# EasyEDA Pro project G-CU_2023-06-21_21-38-10.eprj, schematic Schematic1
Manufacturer Part: BH-18650-B1BA002; Supplier Part: C2988620; Create Date: 2023-06-21; Page Name: P1; Project Name: G-CU_2023-06-21_21-38-10; Schematic Name: Schematic1; Update Date: 2023-06-28; Company: 嘉立创EDA; Page Size: A4; Version: V1.0
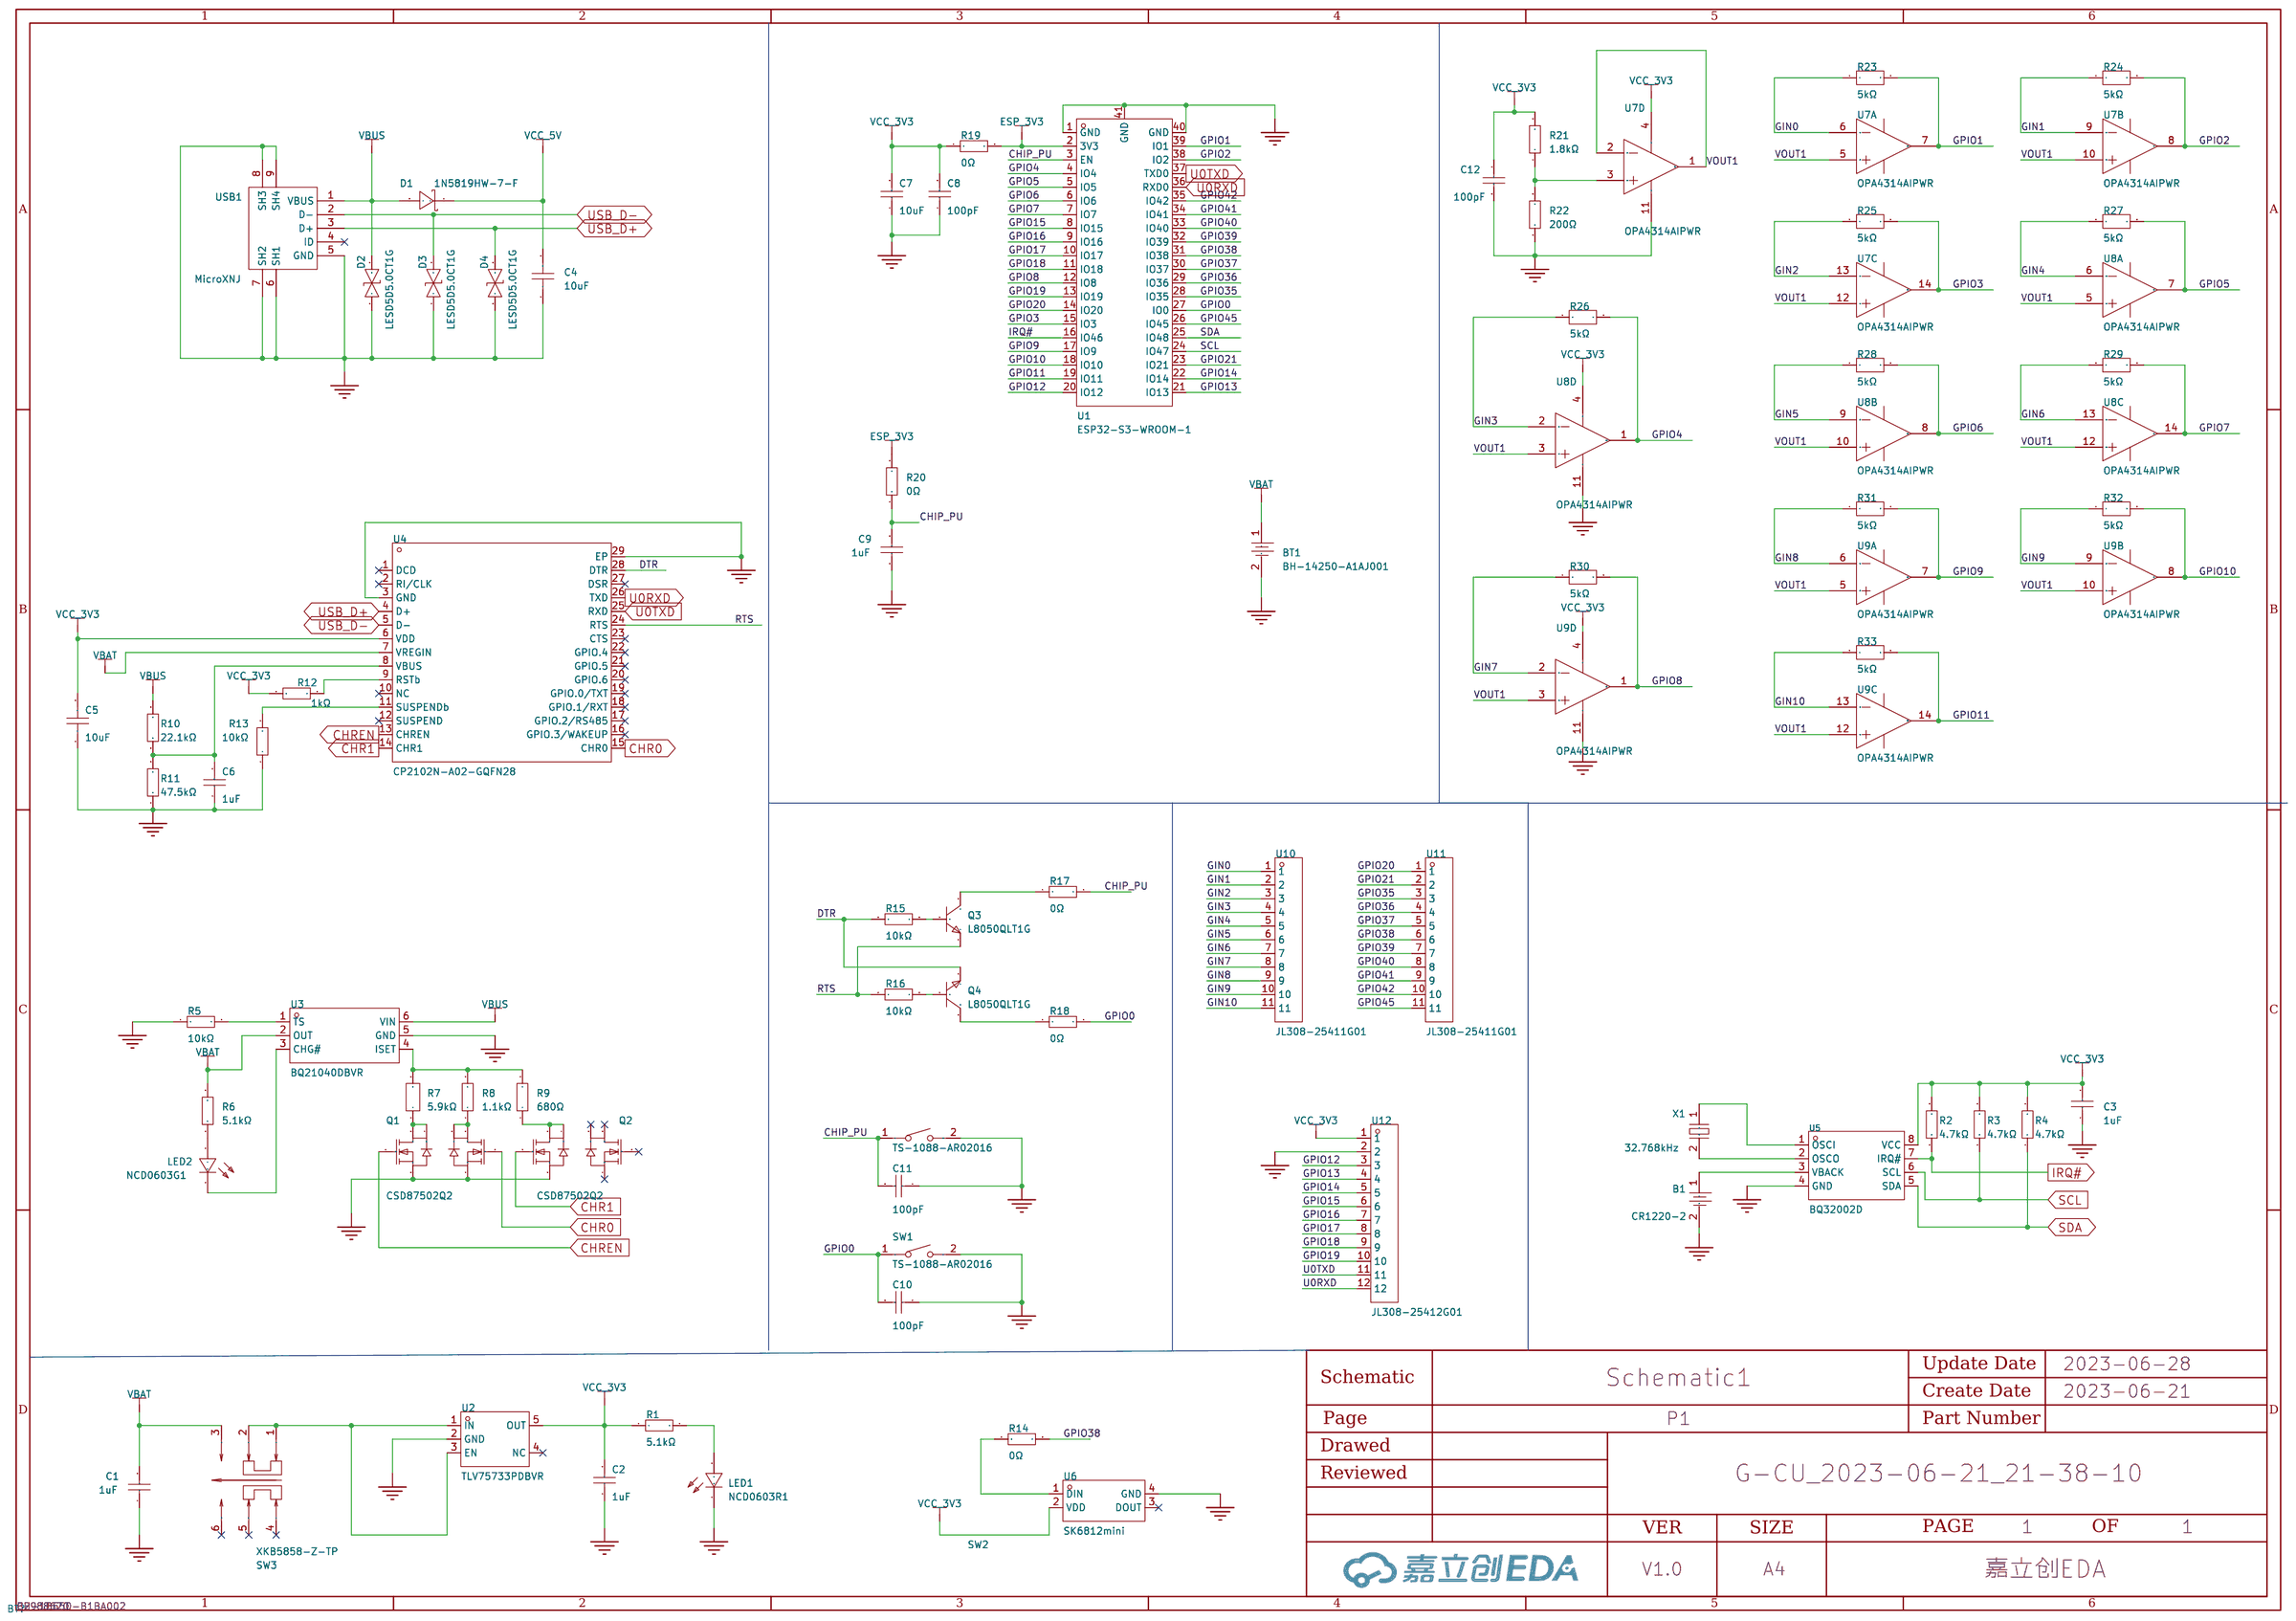
[diagram p0: schematic sheet]

## Parts
B1  CR1220-2  [BAT-SMD_CR1220-2]
BT1  BH-14250-A1AJ001  [14250]
C1  1uF  [C0402]
C2  1uF  [C0402]
C3  1uF  [C0402]
C4  10uF  [C0603]
C5  10uF  [C0603]
C6  1uF  [C0603]
C7  10uF  [C0402]
C8  100pF  [C0402]
C9  1uF  [C0402]
C10  100pF  [C0402]
C11  100pF  [C0402]
C12  100pF  [C0402]
D1  1N5819HW-7-F  [SOD-123_L2.7-W1.6-LS3.7-RD]
D2  LESD5D5.0CT1G  [SOD-523_L1.2-W0.8-LS1.6-BI]
D3  LESD5D5.0CT1G  [SOD-523_L1.2-W0.8-LS1.6-BI]
D4  LESD5D5.0CT1G  [SOD-523_L1.2-W0.8-LS1.6-BI]
LED1  NCD0603R1  [LED0603-RD_RED]
LED2  NCD0603G1  [LED0603-RD]
Q1  CSD87502Q2  [DFN-6L_L2.0-W2.0-P0.65-BL-EP]
Q2  CSD87502Q2  [DFN-6L_L2.0-W2.0-P0.65-BL-EP]
Q3  L8050QLT1G  [SOT-23-3_L2.9-W1.3-P1.90-LS2.4-BR]
Q4  L8050QLT1G  [SOT-23-3_L2.9-W1.3-P1.90-LS2.4-BR]
R1  5.1kΩ  [R0402]
R2  4.7kΩ  [R0402]
R3  4.7kΩ  [R0402]
R4  4.7kΩ  [R0402]
R5  10kΩ  [R0402]
R6  5.1kΩ  [R0402]
R7  5.9kΩ  [R0402]
R8  1.1kΩ  [R0402]
R9  680Ω  [R0402]
R10  22.1kΩ  [R0402]
R11  47.5kΩ  [R0402]
R12  1kΩ  [R0402]
R13  10kΩ  [R0402]
R14  0Ω  [R0402]
R15  10kΩ  [R0402]
R16  10kΩ  [R0402]
R17  0Ω  [R0402]
R18  0Ω  [R0402]
R19  0Ω  [R0402]
R20  0Ω  [R0402]
R21  1.8kΩ  [R0402]
R22  200Ω  [R0402]
R23  5kΩ  [R0603]
R24  5kΩ  [R0603]
R25  5kΩ  [R0603]
R26  5kΩ  [R0603]
R27  5kΩ  [R0603]
R28  5kΩ  [R0603]
R29  5kΩ  [R0603]
R30  5kΩ  [R0603]
R31  5kΩ  [R0603]
R32  5kΩ  [R0603]
R33  5kΩ  [R0603]
SW1  TS-1088-AR02016  [SW-SMD_L3.9-W3.0-P4.45]
SW2  TS-1088-AR02016  [SW-SMD_L3.9-W3.0-P4.45]
SW3  XKB5858-Z-TP  [SW-SMD_6P-L5.8-W5.8-P2.00-LS8.5-1]
U1  ESP32-S3-WROOM-1  [WIRELM-SMD_ESP32-S3-WROOM-1]
U2  TLV75733PDBVR  [SOT-23-5_L2.9-W1.6-P0.95-LS2.8-BL]
U3  BQ21040DBVR  [SOT-23-6_L2.9-W1.6-P0.95-LS2.8-BR]
U4  CP2102N-A02-GQFN28  [QFN-28_L5.0-W5.0-P0.50-TL-EP3.3]
U5  BQ32002D  [SOIC-8_L4.9-W3.9-P1.27-LS6.0-BL]
U6  SK6812mini  [LED-SMD_4P-L3.7-W3.5-P1.75-BR-SK6812MINI]
U7  OPA4314AIPWR  [TSSOP-14_L5.0-W4.4-P0.65-LS6.4-BL]  (sections 1,2,3,4)
U8  OPA4314AIPWR  [TSSOP-14_L5.0-W4.4-P0.65-LS6.4-BL]  (sections 1,2,3,4)
U9  OPA4314AIPWR  [TSSOP-14_L5.0-W4.4-P0.65-LS6.4-BL]  (sections 1,2,3,4)
U10  JL308-25411G01  [CONN-TH_11P-P2.54_JILN_JL308-25411G01]
U11  JL308-25411G01  [CONN-TH_11P-P2.54_JILN_JL308-25411G01]
U12  JL308-25412G01  [CONN-TH_12P-P2.54_JILN_JL308-25412G01]
USB1  MicroXNJ  [MICRO-USB-SMD_MICROXNJ]
X1  32.768kHz  [CRYSTAL-SMD_L3.2-W1.5]

## Library data of the parts
B1 = CR1220-2: 连接器类型:电池底座;适用电池规格:CR1220;工作温度范围:-;; LCSC Part Name: 电池底座 适用电池:CR1220; Supplier Part: C70381; Manufacturer: Q&J; Supplier Footprint: SMD; JLCPCB Part Class: Extended Part; Datasheet: https://atta.szlcsc.com/upload/public/pdf/source/20160427/1461725216696.pdf; Supplier: LCSC; Connector Type: 电池底座; Battery Type: CR1220
BT1 = 14250: Manufacturer: MYOUNG(美阳); Supplier: LCSC; Supplier Part: C5290178
C1-C3 C9 = CL05A105KP5NNNC: 容值:1uF;精度:±10%;额定电压:10V;材质(温度系数):X5R;; LCSC Part Name: 1uF ±10% 10V; Supplier Part: C14445; Manufacturer: SAMSUNG(三星); Supplier Footprint: 0402; JLCPCB Part Class: Extended Part; Datasheet: https://atta.szlcsc.com/upload/public/pdf/source/20160103/1457707670698.pdf; Supplier: LCSC; Tolerance: ±10%; Voltage Rated: 10V; Temperature Coefficient: X5R
C4 C5 = CL10A106MA8NRNC: 容值:10uF;精度:±20%;额定电压:25V;材质(温度系数):X5R;; LCSC Part Name: 10uF ±20% 25V; Supplier Part: C96446; Manufacturer: SAMSUNG(三星); Supplier Footprint: 0603; JLCPCB Part Class: Basic Part; Datasheet: https://atta.szlcsc.com/upload/public/pdf/source/20170325/1490427913016.pdf; Supplier: LCSC; Tolerance: ±20%; Voltage Rated: 25V; Temperature Coefficient: X5R
C6 = CL10A105KO8NNNC: 容值:1uF;精度:±10%;额定电压:16V;材质(温度系数):X5R;; LCSC Part Name: 1uF ±10% 16V; Supplier Part: C1592; Manufacturer: SAMSUNG(三星); Supplier Footprint: 0603; JLCPCB Part Class: Extended Part; Datasheet: https://atta.szlcsc.com/upload/public/pdf/source/20220919/9FBE606BE0D9532D730F292EB26DC5BB.pdf; Supplier: LCSC; Tolerance: ±10%; Voltage Rated: 16V; Temperature Coefficient: X5R
C7 = CL05A106MQ5NUNC: 容值:10uF;精度:±20%;额定电压:6.3V;材质(温度系数):X5R;; LCSC Part Name: 10uF ±20% 6.3V; Supplier Part: C15525; Manufacturer: SAMSUNG(三星); Supplier Footprint: 0402; JLCPCB Part Class: Basic Part; Datasheet: https://atta.szlcsc.com/upload/public/pdf/source/20220823/2B02EE04F8F211D38A52DCB16EB6BEBA.pdf; Supplier: LCSC; Tolerance: ±20%; Voltage Rated: 6.3V; Temperature Coefficient: X5R
C8 C10-C12 = 0402CG101J500NT: 容值:100pF;精度:±5%;额定电压:50V;材质(温度系数):C0G;; LCSC Part Name: 100pF ±5% 50V; Supplier Part: C1546; Manufacturer: FH(风华); Supplier Footprint: 0402; JLCPCB Part Class: Basic Part; Datasheet: https://atta.szlcsc.com/upload/public/pdf/source/20170923/C1546_1506149265265988353.pdf; Supplier: LCSC; Tolerance: ±5%; Voltage Rated: 50V; Temperature Coefficient: C0G
D1 = 1N5819HW-7-F: 直流反向耐压(Vr):40V;平均整流电流(Io):1A;正向压降(Vf):450mV@1A;; LCSC Part Name: 40V 1A 450mV@1A; Supplier Part: C82544; Manufacturer: DIODES(美台); Supplier Footprint: SOD-123; JLCPCB Part Class: Extended Part; Datasheet: https://atta.szlcsc.com/upload/public/pdf/source/20161024/1477288459223.pdf; Supplier: LCSC; Reverse Voltage (Vr): 40V; Average Rectified Current (Io): 1A; Forward Voltage (Vf@If): 450mV@1A
D2-D4 = LESD5D5.0CT1G: 极性:双向;反向截止电压(Vrwm):5V;击穿电压(VBR):5.6V;钳位电压(Vc)@Ipp:18.6V;; LCSC Part Name: 双向ESD; Supplier Part: C383211; Manufacturer: LRC(乐山无线电); Supplier Footprint: SOD-523; JLCPCB Part Class: Extended Part; Datasheet: https://atta.szlcsc.com/upload/public/pdf/source/20190807/C383211_633DF4B4E2C161403226E5235FE33A1C.pdf; Supplier: LCSC; Polarity: 双向; Reverse Stand-Off Voltage (Vrwm): 5V; Breakdown Voltage (VBR): 5.6V; Peak Pulse Current(Ipp)@8/20us: 9.4A; Clamping Voltage@Ipp: 18.6V
LED1 = NCD0603R1_C84263: 发光颜色:红灯;; LCSC Part Name: 红灯; Supplier Part: C84263; Manufacturer: 国星光电; Supplier Footprint: 0603; JLCPCB Part Class: Extended Part; Datasheet: https://atta.szlcsc.com/upload/public/pdf/source/20200820/C84263_DABC6A75E58F576973B407FDBA283D60.pdf; Supplier: LCSC; Emitted Color: 红灯
LED2 = NCD0603G1: 发光颜色:翠绿;; LCSC Part Name: 翠绿; Supplier Part: C84267; Manufacturer: 国星光电; Supplier Footprint: 0603; JLCPCB Part Class: Extended Part; Datasheet: https://atta.szlcsc.com/upload/public/pdf/source/20200820/C84267_04BA7703640BAC111D09F5EFB971FBF3.pdf; Supplier: LCSC; Emitted Color: 翠绿
Q1 Q2 = CSD87502Q2: 类型:2个N沟道;漏源电压(Vdss):30V;连续漏极电流(Id):5A;功率(Pd):2.3W;导通电阻(RDS(on)@Vgs,Id):32.4mΩ@10V,4A;; LCSC Part Name: 2个N沟道 30V 5A; Supplier Part: C701752; Manufacturer: TI(德州仪器); Supplier Footprint: DFN-6L-EP(2x2); JLCPCB Part Class: Extended Part; Supplier: LCSC; Type: 2个N沟道; Drain Source Voltage (Vdss): 30V; Continuous Drain Current (Id): 5A; Power Dissipation (Pd): 2.3W; Drain Source On Resistance (RDS(on)@Vgs,Id): 32.4mΩ@10V,4A; Gate Threshold Voltage (Vgs(th)@Id): 2V@250uA
Q3 Q4 = L8050QLT1G: 晶体管类型:NPN;集射极击穿电压(Vceo):25V;集电极电流(Ic):800mA;功率(Pd):225mW;; LCSC Part Name: NPN 25V 800mA; Supplier Part: C49581; Manufacturer: LRC(乐山无线电); Supplier Footprint: SOT-23; JLCPCB Part Class: Extended Part; Datasheet: https://atta.szlcsc.com/upload/public/pdf/source/20150518/1457707314424.pdf; Supplier: LCSC; Transistor Type: NPN; Collector-Emitter Breakdown Voltage (Vceo): 25V; Collector Current (Ic): 800mA; Power Dissipation (Pd): 225mW
R1 R6 = 0402WGF5101TCE: 电阻类型:厚膜电阻;阻值:5.1kΩ;精度:±1%;功率:62.5mW;; LCSC Part Name: 5.1kΩ ±1% 62.5mW; Supplier Part: C25905; Manufacturer: UNI-ROYAL(厚声); Supplier Footprint: 0402; JLCPCB Part Class: Basic Part; Datasheet: https://atta.szlcsc.com/upload/public/pdf/source/20200306/C422600_1E6D84923E4A46A82E41ADD87F860B5C.pdf; Supplier: LCSC; Type: 厚膜电阻; Tolerance: ±1%; Power(Watts): 62.5mW; Temperature Coefficient: ±100ppm/℃; Overload Voltage (Max): 50V; Operating Temperature Range: -55℃~+155℃
R2-R4 = 0402WGF4701TCE: 电阻类型:厚膜电阻;阻值:4.7kΩ;精度:±1%;功率:62.5mW;; LCSC Part Name: 4.7kΩ ±1% 62.5mW; Supplier Part: C25900; Manufacturer: UNI-ROYAL(厚声); Supplier Footprint: 0402; JLCPCB Part Class: Basic Part; Datasheet: https://atta.szlcsc.com/upload/public/pdf/source/20200306/C422600_1E6D84923E4A46A82E41ADD87F860B5C.pdf; Supplier: LCSC; Type: 厚膜电阻; Tolerance: ±1%; Power(Watts): 62.5mW; Temperature Coefficient: ±100ppm/℃; Overload Voltage (Max): 50V; Operating Temperature Range: -55℃~+155℃
R5 R13 R15 R16 = 0402WGF1002TCE: 电阻类型:厚膜电阻;阻值:10kΩ;精度:±1%;功率:62.5mW;; LCSC Part Name: 10kΩ ±1% 62.5mW; Supplier Part: C25744; Manufacturer: UNI-ROYAL(厚声); Supplier Footprint: 0402; JLCPCB Part Class: Basic Part; Datasheet: https://atta.szlcsc.com/upload/public/pdf/source/20200306/C422600_1E6D84923E4A46A82E41ADD87F860B5C.pdf; Supplier: LCSC; Type: 厚膜电阻; Tolerance: ±1%; Power(Watts): 62.5mW; Temperature Coefficient: ±100ppm/℃; Overload Voltage (Max): 50V; Operating Temperature Range: -55℃~+155℃
R7 = RC0402FR-075K9L: 电阻类型:厚膜电阻;阻值:5.9kΩ;精度:±1%;功率:62.5mW;温度系数:±100ppm/℃;最大工作电压:50V;工作温度范围:-55℃~+125℃;; LCSC Part Name: 5.9kΩ ±1% 62.5mW; Supplier Part: C273691; Manufacturer: YAGEO(国巨); Supplier Footprint: 0402; JLCPCB Part Class: Extended Part; Datasheet: https://atta.szlcsc.com/upload/public/pdf/source/20190227/C273691_BBAD9A12C61A71838B3E42E1601FFEDF.pdf; Supplier: LCSC; Type: 厚膜电阻; Tolerance: ±1%; Power(Watts): 62.5mW; Temperature Coefficient: ±100ppm/℃; Overload Voltage (Max): 50V; Operating Temperature Range: -55℃~+125℃
R8 = 0402WGF1101TCE: 电阻类型:厚膜电阻;阻值:1.1kΩ;精度:±1%;功率:62.5mW;; LCSC Part Name: 1.1kΩ ±1% 62.5mW; Supplier Part: C25860; Manufacturer: UNI-ROYAL(厚声); Supplier Footprint: 0402; JLCPCB Part Class: Extended Part; Datasheet: https://atta.szlcsc.com/upload/public/pdf/source/20200306/C422600_1E6D84923E4A46A82E41ADD87F860B5C.pdf; Supplier: LCSC; Type: 厚膜电阻; Tolerance: ±1%; Power(Watts): 62.5mW; Temperature Coefficient: ±100ppm/℃; Overload Voltage (Max): 50V; Operating Temperature Range: -55℃~+155℃
R9 = 0402WGF6800TCE: 电阻类型:厚膜电阻;阻值:680Ω;精度:±1%;功率:62.5mW;; LCSC Part Name: 680Ω ±1% 62.5mW; Supplier Part: C25130; Manufacturer: UNI-ROYAL(厚声); Supplier Footprint: 0402; JLCPCB Part Class: Basic Part; Datasheet: https://atta.szlcsc.com/upload/public/pdf/source/20200306/C422600_1E6D84923E4A46A82E41ADD87F860B5C.pdf; Supplier: LCSC; Type: 厚膜电阻; Tolerance: ±1%; Power(Watts): 62.5mW; Temperature Coefficient: ±100ppm/℃; Overload Voltage (Max): 50V; Operating Temperature Range: -55℃~+155℃
R10 = 0402WGF2212TCE: 电阻类型:厚膜电阻;阻值:22.1kΩ;精度:±1%;功率:62.5mW;; LCSC Part Name: 22.1kΩ ±1% 62.5mW; Supplier Part: C43473; Manufacturer: UNI-ROYAL(厚声); Supplier Footprint: 0402; JLCPCB Part Class: Extended Part; Datasheet: https://atta.szlcsc.com/upload/public/pdf/source/20200306/C422600_1E6D84923E4A46A82E41ADD87F860B5C.pdf; Supplier: LCSC; Type: 厚膜电阻; Tolerance: ±1%; Power(Watts): 62.5mW; Temperature Coefficient: ±100ppm/℃; Overload Voltage (Max): 50V; Operating Temperature Range: -55℃~+155℃
R11 = 0402WGF4752TCE: 电阻类型:厚膜电阻;阻值:47.5kΩ;精度:±1%;功率:62.5mW;; LCSC Part Name: 47.5kΩ ±1% 62.5mW; Supplier Part: C25896; Manufacturer: UNI-ROYAL(厚声); Supplier Footprint: 0402; JLCPCB Part Class: Extended Part; Datasheet: https://atta.szlcsc.com/upload/public/pdf/source/20200306/C422600_1E6D84923E4A46A82E41ADD87F860B5C.pdf; Supplier: LCSC; Type: 厚膜电阻; Tolerance: ±1%; Power(Watts): 62.5mW; Temperature Coefficient: ±100ppm/℃; Overload Voltage (Max): 50V; Operating Temperature Range: -55℃~+155℃
R12 = 0402WGF1001TCE: 电阻类型:厚膜电阻;阻值:1kΩ;精度:±1%;功率:62.5mW;; LCSC Part Name: 1kΩ ±1% 62.5mW; Supplier Part: C11702; Manufacturer: UNI-ROYAL(厚声); Supplier Footprint: 0402; JLCPCB Part Class: Basic Part; Datasheet: https://atta.szlcsc.com/upload/public/pdf/source/20200306/C422600_1E6D84923E4A46A82E41ADD87F860B5C.pdf; Supplier: LCSC; Type: 厚膜电阻; Tolerance: ±1%; Power(Watts): 62.5mW; Temperature Coefficient: ±100ppm/℃; Overload Voltage (Max): 50V; Operating Temperature Range: -55℃~+155℃
R14 R17-R20 = 0402WGJ0000TCE: 电阻类型:厚膜电阻;阻值:0Ω;精度:±5%;功率:62.5mW;; LCSC Part Name: 0Ω ±5% 62.5mW; Supplier Part: C21376; Manufacturer: UNI-ROYAL(厚声); Supplier Footprint: 0402; JLCPCB Part Class: Extended Part; Datasheet: https://atta.szlcsc.com/upload/public/pdf/source/20200306/C422600_1E6D84923E4A46A82E41ADD87F860B5C.pdf; Supplier: LCSC; Type: 厚膜电阻; Tolerance: ±5%; Power(Watts): 62.5mW; Overload Voltage (Max): 50V; Operating Temperature Range: -55℃~+155℃
R21 = 0402WGF1801TCE: 电阻类型:厚膜电阻;阻值:1.8kΩ;精度:±1%;功率:62.5mW;; LCSC Part Name: 1.8kΩ ±1% 62.5mW; Supplier Part: C25871; Manufacturer: UNI-ROYAL(厚声); Supplier Footprint: 0402; JLCPCB Part Class: Extended Part; Datasheet: https://atta.szlcsc.com/upload/public/pdf/source/20200306/C422600_1E6D84923E4A46A82E41ADD87F860B5C.pdf; Supplier: LCSC; Type: 厚膜电阻; Tolerance: ±1%; Power(Watts): 62.5mW; Temperature Coefficient: ±100ppm/℃; Overload Voltage (Max): 50V; Operating Temperature Range: -55℃~+155℃
R22 = 0402WGF2000TCE: 电阻类型:厚膜电阻;阻值:200Ω;精度:±1%;功率:62.5mW;; LCSC Part Name: 200Ω ±1% 62.5mW; Supplier Part: C25087; Manufacturer: UNI-ROYAL(厚声); Supplier Footprint: 0402; JLCPCB Part Class: Basic Part; Datasheet: https://atta.szlcsc.com/upload/public/pdf/source/20200306/C422600_1E6D84923E4A46A82E41ADD87F860B5C.pdf; Supplier: LCSC; Type: 厚膜电阻; Tolerance: ±1%; Power(Watts): 62.5mW; Temperature Coefficient: ±100ppm/℃; Overload Voltage (Max): 50V; Operating Temperature Range: -55℃~+155℃
R23-R33 = AR03BTCX5001: 电阻类型:薄膜电阻;阻值:5kΩ;精度:±0.1%;功率:100mW;; LCSC Part Name: 5kΩ ±0.1% 100mW; Supplier Part: C2828621; Manufacturer: Viking(光颉); Supplier Footprint: 0603; JLCPCB Part Class: Extended Part; Datasheet: https://atta.szlcsc.com/upload/public/pdf/source/20211009/C2828621_7F88408CB1D09DFC08036051E0A6050B.pdf; Supplier: LCSC; Type: 薄膜电阻; Tolerance: ±0.1%; Power(Watts): 100mW; Temperature Coefficient: ±25ppm/℃; Overload Voltage (Max): 50V; Operating Temperature Range: -55℃~+155℃
SW1 SW2 = TS-1088-AR02016: 触点电流:50mA;额定电压(DC):12V;绝缘电阻:100MΩ;电路结构:单刀单掷;安装方式:立贴;作用力:160gf@±50gf;机械寿命:10万次;带支架:否;; LCSC Part Name: 4*3*2mm 立贴 轻触开关; Supplier Part: C720477; Manufacturer: XUNPU(讯普); Supplier Footprint: SMD; JLCPCB Part Class: Extended Part; Datasheet: https://atta.szlcsc.com/upload/public/pdf/source/20200810/C720475_60D09DD6C54279ADDB2DC25100F1CC11.pdf; Supplier: LCSC; Contact Current: 50mA; Voltage Rating (DC): 12V; Insulation Resistance: 100MΩ; Circuit: 单刀单掷; Mounting Style: 立贴; Actuator Style: 圆形按钮; Actuator/Cap Color: 黑色; Operating Force: 160gf@±50gf; Mechanical Life: 10万次; Operating Temperature: -30℃~+80℃; Pin Style: SMD接片; Switch Length: 4mm; Switch Width: 3mm; Switch Height: 2mm; Strike Gundam: 否
SW3 = XKB5858-Z-TP: 触点电流:100mA;额定电压 (AC):250V;额定电压 (DC):30V;绝缘电阻:100MΩ;安装方式:立贴;自锁/无锁:自锁;按键形状:方形按钮;按键/盖帽颜色:白色;带灯:无;引脚样式:SMD接片;作用力:160gf@±80gf;防护等级:-;工作温度:-15℃~+55℃;机械寿命:100000;; LCSC Part Name: XKB5858-Z-TP 自锁; Supplier Part: C840833; Manufacturer: XKB Connectivity(中国星坤); Supplier Footprint: SMD; JLCPCB Part Class: Extended Part; Datasheet: https://atta.szlcsc.com/upload/public/pdf/source/20211011/AE8D1C6B8E6A5387F65392BE419A90C8.pdf; Supplier: LCSC; Contact Current: 100mA; Voltage Rating (AC): 250V; Voltage Rating (DC): 30V; Insulation Resistance: 100MΩ; Mounting Style: 立贴; Self Lock / No Lock: 自锁; Actuator Style: 方形按钮; Actuator/Cap Color: 白色; With Lamp: 无; Pin Style: SMD接片; Operating Force: 160gf@±80gf; Operating Temperature: -15℃~+55℃; Mechanical Life: 100000
U1 = ESP32-S3-WROOM-1: LCSC Part Name: ESP32-S2-SOLO-2-N4; Supplier Part: C3040594; Manufacturer: ESPRESSIF(乐鑫); JLCPCB Part Class: Extended Part; Datasheet: https://atta.szlcsc.com/upload/public/pdf/source/20220829/68E69EF550BFD22B9418B9E05FF4E453.pdf; Supplier: LCSC
U2 = TLV75733PDBVR: 输出类型:固定;输出极性:正;输出通道数:1;最大输入电压:5.5V;输出电压:3.3V;压差:475mV@(1A);输出电流:1A;电源纹波抑制比(PSRR):52dB;; LCSC Part Name: 正 Vin=5.5V Vout=3.3V 1A 52dB; Supplier Part: C485517; Manufacturer: TI(德州仪器); Supplier Footprint: SOT-23-5; JLCPCB Part Class: Extended Part; Datasheet: https://atta.szlcsc.com/upload/public/pdf/source/20200225/C485517_6B29D09EDAFD9A781E45EE8E3C6E09A4.pdf; Supplier: LCSC; Output Type: 固定; Output Polarity: 正; Number of Outputs: 1; Maximum Input Voltage: 5.5V; Output Voltage: 3.3V; Dropout Voltage: 475mV@(1A); Output Current: 1A; Power Supply Rejection Ratio (PSRR): 52dB
U3 = BQ21040DBVR: 电池类型:锂离子/聚合物;电池节数:1;最大充电电流:800mA;电源电压:6.45V;; Supplier Part: C202311; Manufacturer: TI(德州仪器); Supplier Footprint: SOT-23-6; JLCPCB Part Class: Extended Part; Datasheet: https://atta.szlcsc.com/upload/public/pdf/source/20180412/C202311_69E9FC455D67F52C33ED3C60972DCB90.pdf; Supplier: LCSC; Type of Battery: 锂离子/聚合物; Number of Cells: 1; Maximum Charge Current: 800mA; Supply Voltage: 6.45V; Operating Temperature: 0℃~+125℃
U4 = CP2102N-A02-GQFN28: Supplier Part: C1550553; Manufacturer: SILICON LABS(芯科); Supplier Footprint: QFN-28(5x5); JLCPCB Part Class: Extended Part; Datasheet: https://atta.szlcsc.com/upload/public/pdf/source/20201204/C964632_F2B790CC23A72455AEF523510305B30A.pdf; Supplier: LCSC
U5 = BQ32002D: 实时时钟 (RTC) 8-SOIC -40 to 85; Supplier Part: C2861334; Manufacturer: TI(德州仪器); Supplier Footprint: SOIC-8; JLCPCB Part Class: Extended Part; Datasheet: https://www.ti.com/cn/lit/gpn/bq32002; Supplier: LCSC
U6 = SK6812mini: Supplier Part: C2886570; Manufacturer: 欧思科光电; Supplier Footprint: SMD; JLCPCB Part Class: Extended Part; Datasheet: https://atta.szlcsc.com/upload/public/pdf/source/20230417/4A68877D1EE94768BDE7A1DE8196F30D.pdf; Supplier: LCSC
U7-U9 = OPA4314AIPWR: OPA4314 四路、3MHz、低功耗、低噪声、RRI/O、1.8V CMOS 运算放大器; Supplier Part: C129333; Manufacturer: TI(德州仪器); Supplier Footprint: TSSOP-14; JLCPCB Part Class: Extended Part; Datasheet: https://atta.szlcsc.com/upload/public/pdf/source/20170914/C129333_1505359967979968173.pdf; Supplier: LCSC
U10 U11 = JL308-25411G01: 间距:2.54mm;排数:1;每排PIN数:11;安装方式:直针;额定电流:6A;额定电压:150V;线规 - AWG:18~26;线规 - mm?:-;工作温度范围:-40℃~+105℃;颜色:绿色;; LCSC Part Name: 2.54mm 排数:1 每排P数:11 直针; Supplier Part: C2922606; Manufacturer: JILN(锦凌); Supplier Footprint: 直插,P=2.54mm; JLCPCB Part Class: Extended Part; Datasheet: https://atta.szlcsc.com/upload/public/pdf/source/20211202/F7F2A4D6BD37BB78E5B0E5A6BD4E8446.pdf; Supplier: LCSC; Pitch: 2.54mm; Number of Rows: 1; Number of PINs Per Row: 11; Mounting Style: 直针; Current Rating (Max): 6A; Voltage Rating (Max): 150V; Wire Gauge - AWG: 18~26; Operating Temperature Range: -40℃~+105℃; Color: 绿色
U12 = JL308-25412G01: 间距:2.54mm;排数:1;每排PIN数:12;安装方式:直针;额定电流:6A;额定电压:150V;线规 - AWG:18~26;线规 - mm?:-;工作温度范围:-40℃~+105℃;颜色:绿色;; LCSC Part Name: 2.54mm 排数:1 每排P数:12 直针; Supplier Part: C2922607; Manufacturer: JILN(锦凌); Supplier Footprint: 直插,P=2.54mm; JLCPCB Part Class: Extended Part; Datasheet: https://atta.szlcsc.com/upload/public/pdf/source/20211202/F7F2A4D6BD37BB78E5B0E5A6BD4E8446.pdf; Supplier: LCSC; Pitch: 2.54mm; Number of Rows: 1; Number of PINs Per Row: 12; Mounting Style: 直针; Current Rating (Max): 6A; Voltage Rating (Max): 150V; Wire Gauge - AWG: 18~26; Operating Temperature Range: -40℃~+105℃; Color: 绿色
USB1 = MicroXNJ: 连接器类型:Micro-B;标准:USB 2.0;公母:母座;触点数量:5;端口数量:1;安装方式:卧贴;额定电流 - 电源:1A;工作温度范围:-20℃~+85℃;; LCSC Part Name: Micro-B 母座 卧贴; Supplier Part: C404969; Manufacturer: SHOU HAN(首韩); Supplier Footprint: SMD; JLCPCB Part Class: Extended Part; Datasheet: https://atta.szlcsc.com/upload/public/pdf/source/20220415/2494EDFF499AF6F852F7C820374B6AF3.pdf; Supplier: LCSC; Connector Type: Micro-B; Standard: USB 2.0; Gender: 母座; Number of Contacts: 5; Number of Ports: 1; Mounting Style: 卧贴; Current Rating - Power (Max): 1A; Operating Temperature Range: -20℃~+85℃
X1 = Q13FC13500005: 频率:32.768kHz;频率公差:±10ppm;负载电容:12.5pF;; LCSC Part Name: 32.768kHz ±10ppm 12.5pF; Supplier Part: C841881; Manufacturer: EPSON(爱普生); Supplier Footprint: SMD3215-2P; JLCPCB Part Class: Extended Part; Datasheet: https://atta.szlcsc.com/upload/public/pdf/source/20200925/C841881_B5011FDE44C88701FACF3BC62E48B4DA.pdf; Supplier: LCSC; Crystal Type: 贴片无源晶振; Frequency Tolerance: ±10ppm; Load Capacitance: 12.5pF; Equivalent Series Resistance (ESR): 70kΩ; Operating Temperature: -40℃~+85℃

## Nets
GND: B1.2 BT1.2 C1.1 C2.1 C3.1 C4.1 C5.1 C6.1 C7.1 C8.1 C9.1 C10.1 C11.1 C12.2 D2.1 D3.1 D4.1 LED1.1(K) Q1.1(S) Q1.4(S) Q2.1(S) R5.1 R11.1 R13.1 R22.1 SW1.2 SW2.2 U1.1(GND) U1.40(GND) U1.41(GND) U2.2(GND) U3.5(GND) U4.3(GND) U4.29(EP) U5.4(GND) U6.4(GND) U7.11(V-) U8.11(V-) U9.11(V-) U12.2 USB1.5(GND) USB1.6(SH1) USB1.7(SH2) USB1.8(SH3) USB1.9(SH4)
VBAT: BT1.1 C1.2 R6.2 SW3.3 U3.2(OUT) U4.7(VREGIN)
VBUS: D1.2(A) D2.2 R10.2 U3.6(VIN) USB1.1(VBUS)
VCC_3V3: C2.2 C3.2 C5.2 C7.2 C8.2 C12.1 R1.1 R2.2 R3.2 R4.2 R12.2 R19.1 R21.2 U2.5(OUT) U4.6(VDD) U5.8(VCC) U6.2(VDD) U7.4(V+) U8.4(V+) U9.4(V+) U12.1
VCC_5V: C4.2 D1.1(K)
CHIP_PU: C9.2 C11.2 R17.2 R20.1 SW2.1 U1.3(EN)
CHR0: Q1.5(G) U4.15(CHR0)
CHR1: Q2.2(G) U4.14(CHR1)
CHREN: Q1.2(G) U4.13(CHREN)
DTR: Q4.2(E) R15.1 U4.28(DTR)
ESP_3V3: R19.2 R20.2 U1.2(3V3)
GIN0: R23.1 U7.6(IN B-) U10.1
GIN1: R24.1 U7.9(IN C-) U10.2
GIN2: R25.1 U7.13(IN D-) U10.3
GIN3: R26.1 U8.2(IN A-) U10.4
GIN4: R27.1 U8.6(IN B-) U10.5
GIN5: R28.1 U8.9(IN C-) U10.6
GIN6: R29.1 U8.13(IN D-) U10.7
GIN7: R30.1 U9.2(IN A-) U10.8
GIN8: R31.1 U9.6(IN B-) U10.9
GIN9: R32.1 U9.9(IN C-) U10.10
GIN10: R33.1 U9.13(IN D-) U10.11
GPIO0: C10.2 R18.2 SW1.1 U1.27(IO0)
GPIO1: R23.2 U1.39(IO1) U7.7(OUT B)
GPIO2: R24.2 U1.38(IO2) U7.8(OUT C)
GPIO3: R25.2 U1.15(IO3) U7.14(OUT D)
GPIO4: R26.2 U1.4(IO4) U8.1(OUT A)
GPIO5: R27.2 U1.5(IO5) U8.7(OUT B)
GPIO6: R28.2 U1.6(IO6) U8.8(OUT C)
GPIO7: R29.2 U1.7(IO7) U8.14(OUT D)
GPIO8: R30.2 U1.12(IO8) U9.1(OUT A)
GPIO9: R31.2 U1.17(IO9) U9.7(OUT B)
GPIO10: R32.2 U1.18(IO10) U9.8(OUT C)
GPIO11: R33.2 U1.19(IO11) U9.14(OUT D)
GPIO12: U1.20(IO12) U12.3
GPIO13: U1.21(IO13) U12.4
GPIO14: U1.22(IO14) U12.5
GPIO15: U1.8(IO15) U12.6
GPIO16: U1.9(IO16) U12.7
GPIO17: U1.10(IO17) U12.8
GPIO18: U1.11(IO18) U12.9
GPIO19: U1.13(IO19) U12.10
GPIO20: U1.14(IO20) U11.1
GPIO21: U1.23(IO21) U11.2
GPIO35: U1.28(IO35) U11.3
GPIO36: U1.29(IO36) U11.4
GPIO37: U1.30(IO37) U11.5
GPIO38: R14.2 U1.31(IO38) U11.6
GPIO39: U1.32(IO39) U11.7
GPIO40: U1.33(IO40) U11.8
GPIO41: U1.34(IO41) U11.9
GPIO42: U1.35(IO42) U11.10
GPIO45: U1.26(IO45) U11.11
IRQ#: R2.1 U1.16(IO46) U5.7(IRQ#)
RTS: Q3.2(E) R16.1 U4.24(RTS)
SCL: R3.1 U1.24(IO47) U5.6(SCL)
SDA: R4.1 U1.25(IO48) U5.5(SDA)
U0RXD: U1.36(RXD0) U4.26(TXD) U12.12
U0TXD: U1.37(TXD0) U4.25(RXD) U12.11
USB_D+: D4.2 U4.4(D+) USB1.3(D+)
USB_D-: D3.2 U4.5(D-) USB1.2(D-)
VOUT1: U7.1(OUT A) U7.2(IN A-) U7.5(IN B+) U7.10(IN C+) U7.12(IN D+) U8.3(IN A+) U8.5(IN B+) U8.10(IN C+) U8.12(IN D+) U9.3(IN A+) U9.5(IN B+) U9.10(IN C+) U9.12(IN D+)
$1N2540: LED1.2(A) R1.2
$1N2933: U5.1(OSCI) X1.1
$1N2943: U5.2(OSCO) X1.2(GND)
$1N2977: B1.1 U5.3(VBACK)
$1N5698: R5.2 U3.1(TS)
$1N5744: LED2.2(A) R6.1
$1N5776: LED2.1(K) U3.3(CHG#)
$1N6032: R7.2 R8.2 R9.2 U3.4(ISET)
$1N6640: Q1.6(D) Q1.7(D) R7.1
$1N6646: Q1.3(D) Q1.8(D) R8.1
$1N6659: Q2.6(D) Q2.7(D) R9.1
$1N7305: C6.2 R10.1 R11.2 U4.8(VBUS)
$1N7502: R12.1 U4.9(RSTb)
$1N7540: R13.2 U4.11(SUSPENDb)
$1N7794: R14.1 U6.1(DIN)
$1N8190: Q3.3(C) R17.1
$1N8194: Q4.3(C) R18.1
$1N8229: Q3.1(B) R15.2
$1N8232: Q4.1(B) R16.2
$1N11489: R21.1 R22.2 U7.3(IN A+)
$1N12314: SW3.1 SW3.2 U2.1(IN) U2.3(EN)

Not connected (* = marked no-connect by the designer): Q2 3(D)* 4(S)* 5(G)* 8(D)*; SW3 4* 5* 6*; U2 4(NC)*; U4 1(DCD)* 2(RI/CLK)* 10(NC)* 12(SUSPEND)* 16(GPIO.3/WAKEUP)* 17(GPIO.2/RS485)* 18(GPIO.1/RXT)* 19(GPIO.0/TXT)* 20(GPIO.6)* 21(GPIO.5)* 22(GPIO.4)* 23(CTS)* 27(DSR)*; U6 3(DOUT)*; USB1 4(ID)*
